# EAGLE board backplane_v4 (EAGLE 8.0.1)
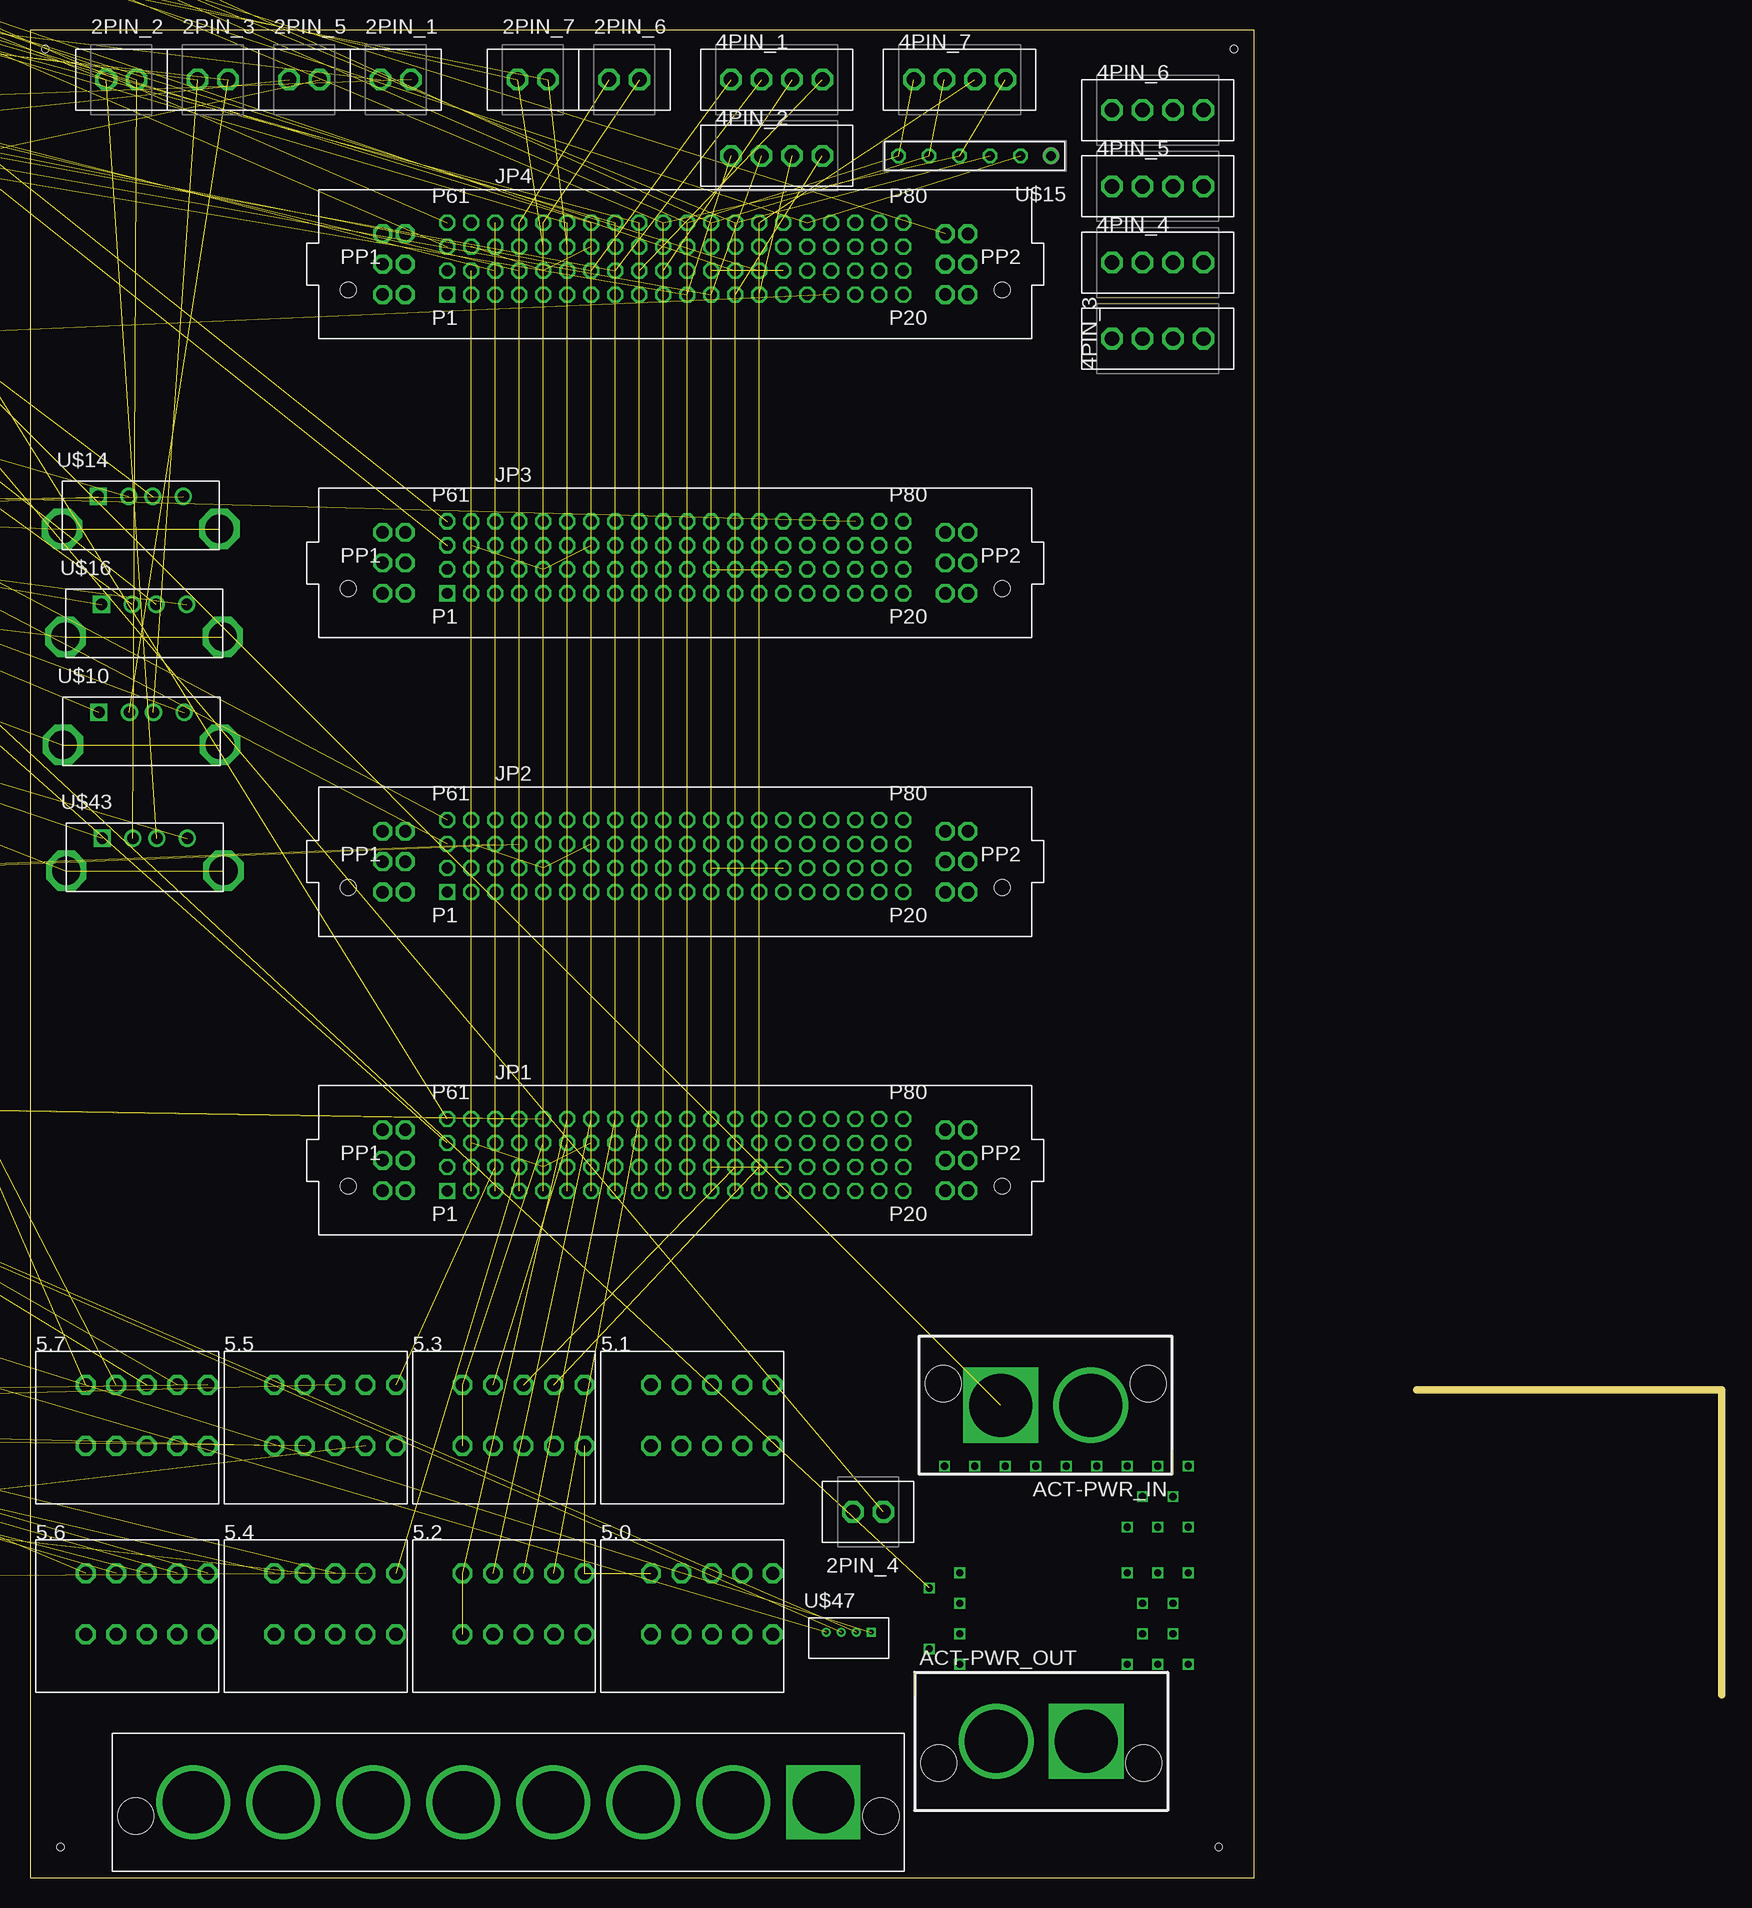
[diagram p6: board, top side]
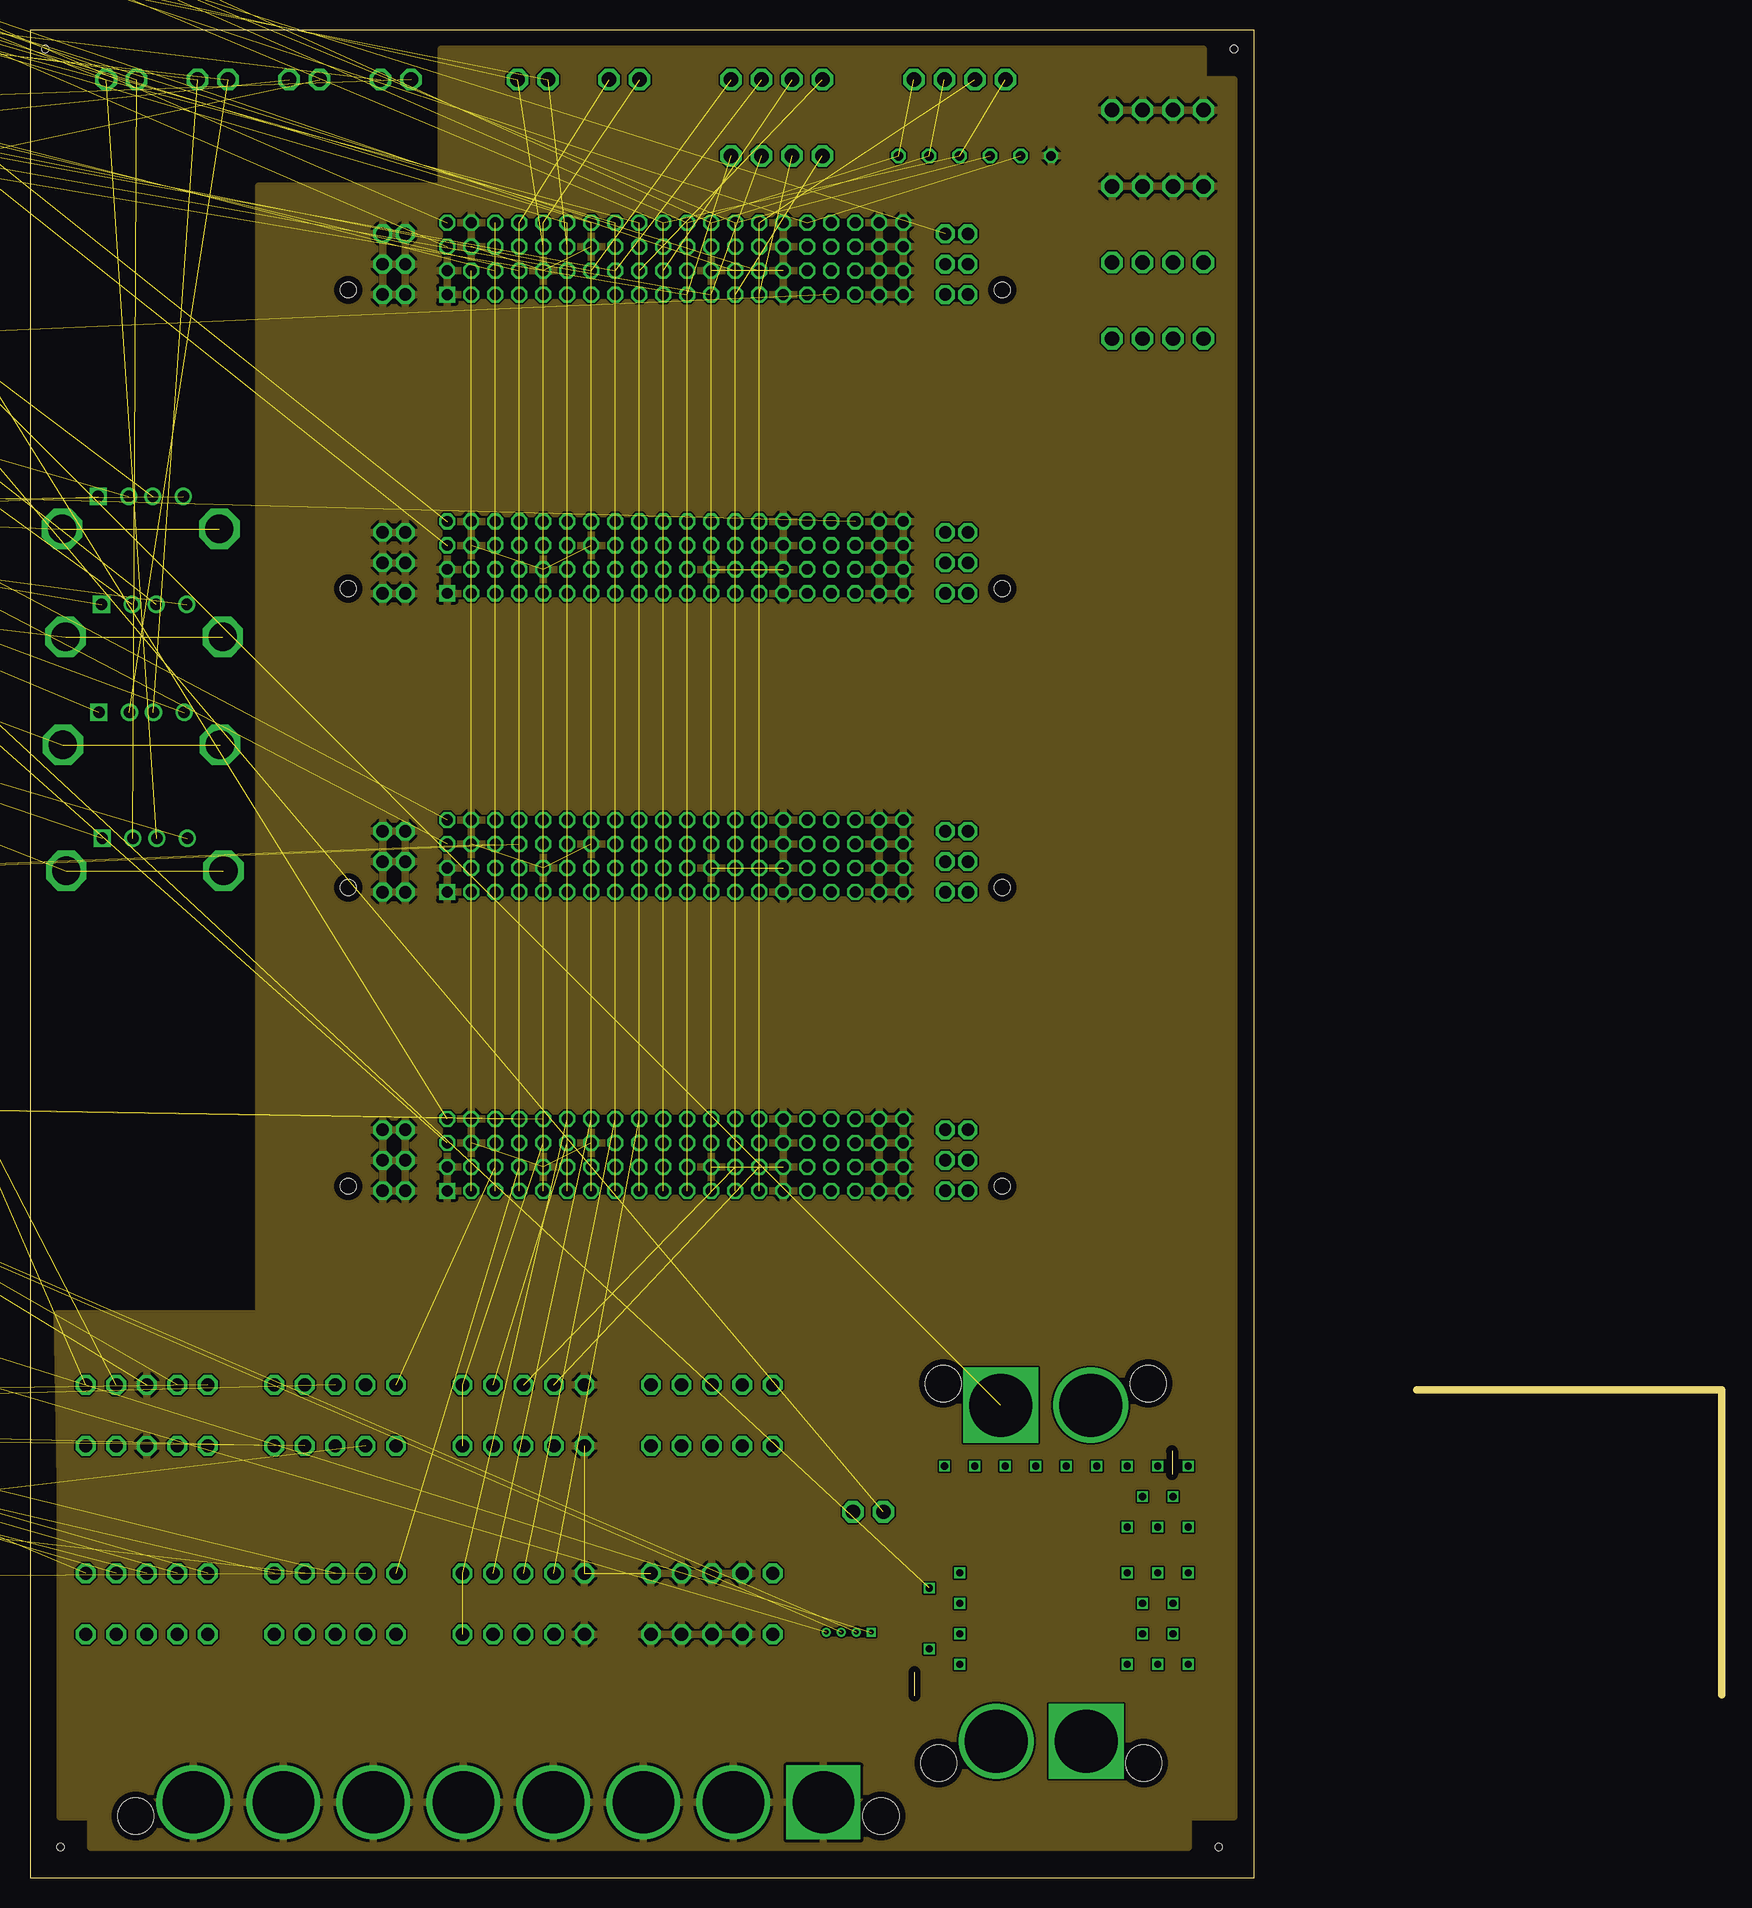
[diagram p7: board, inner layer Route2]
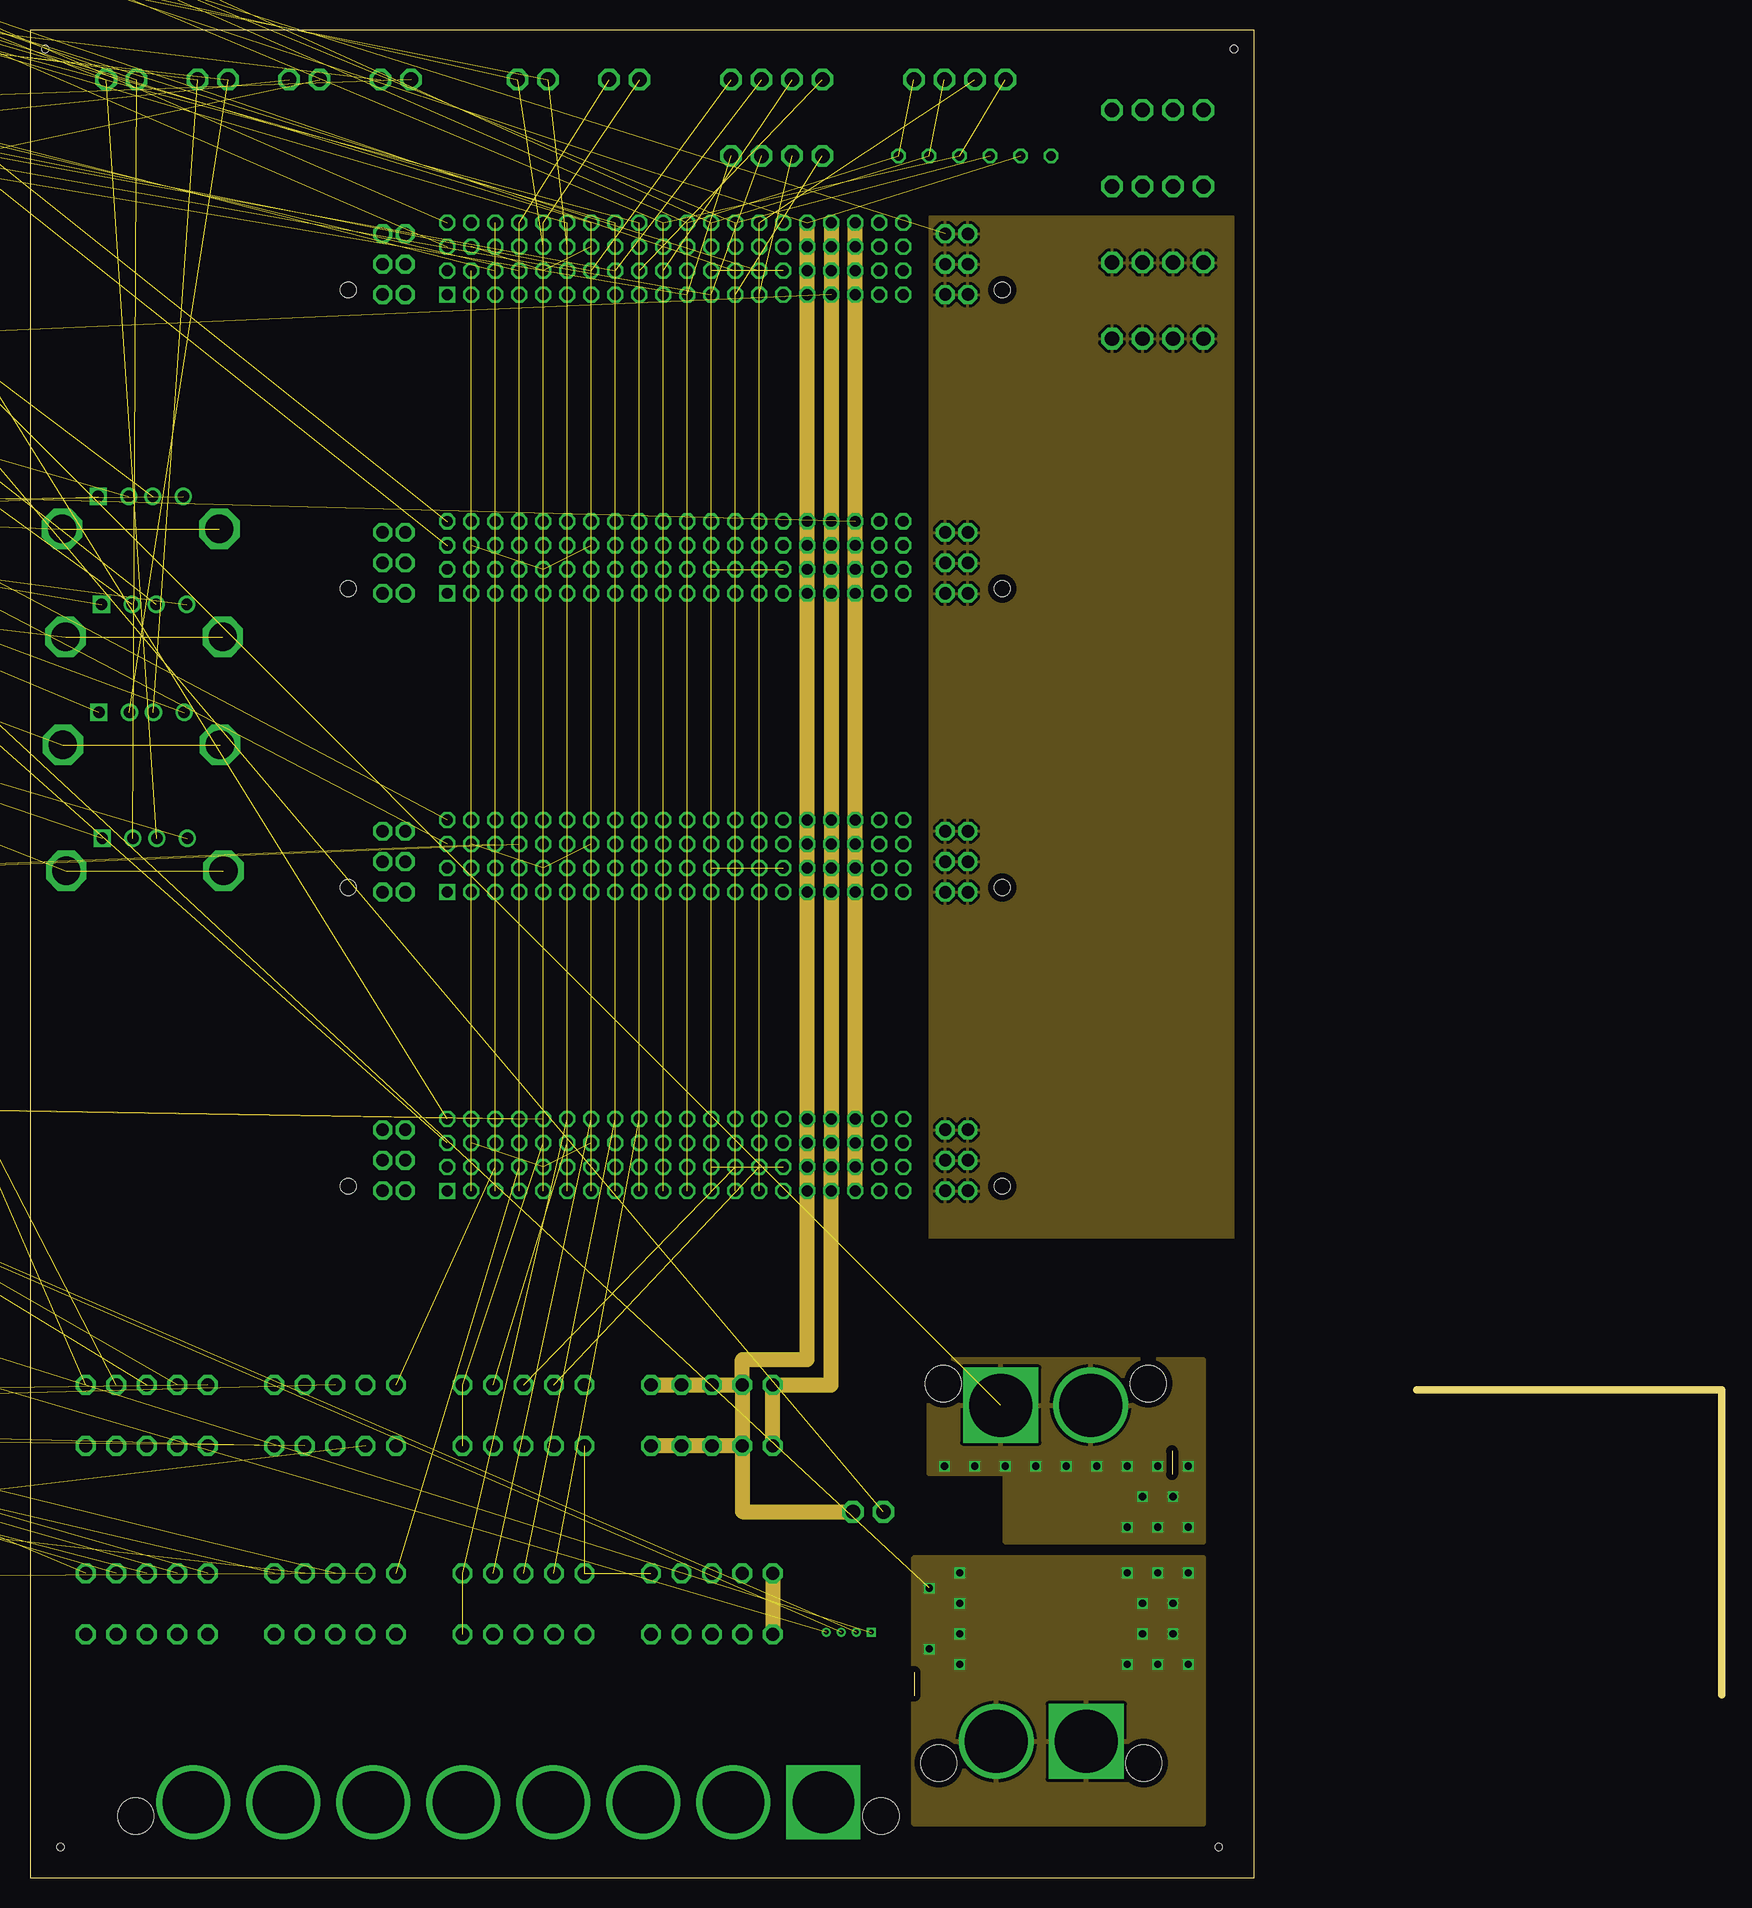
[diagram p8: board, inner layer Route15]
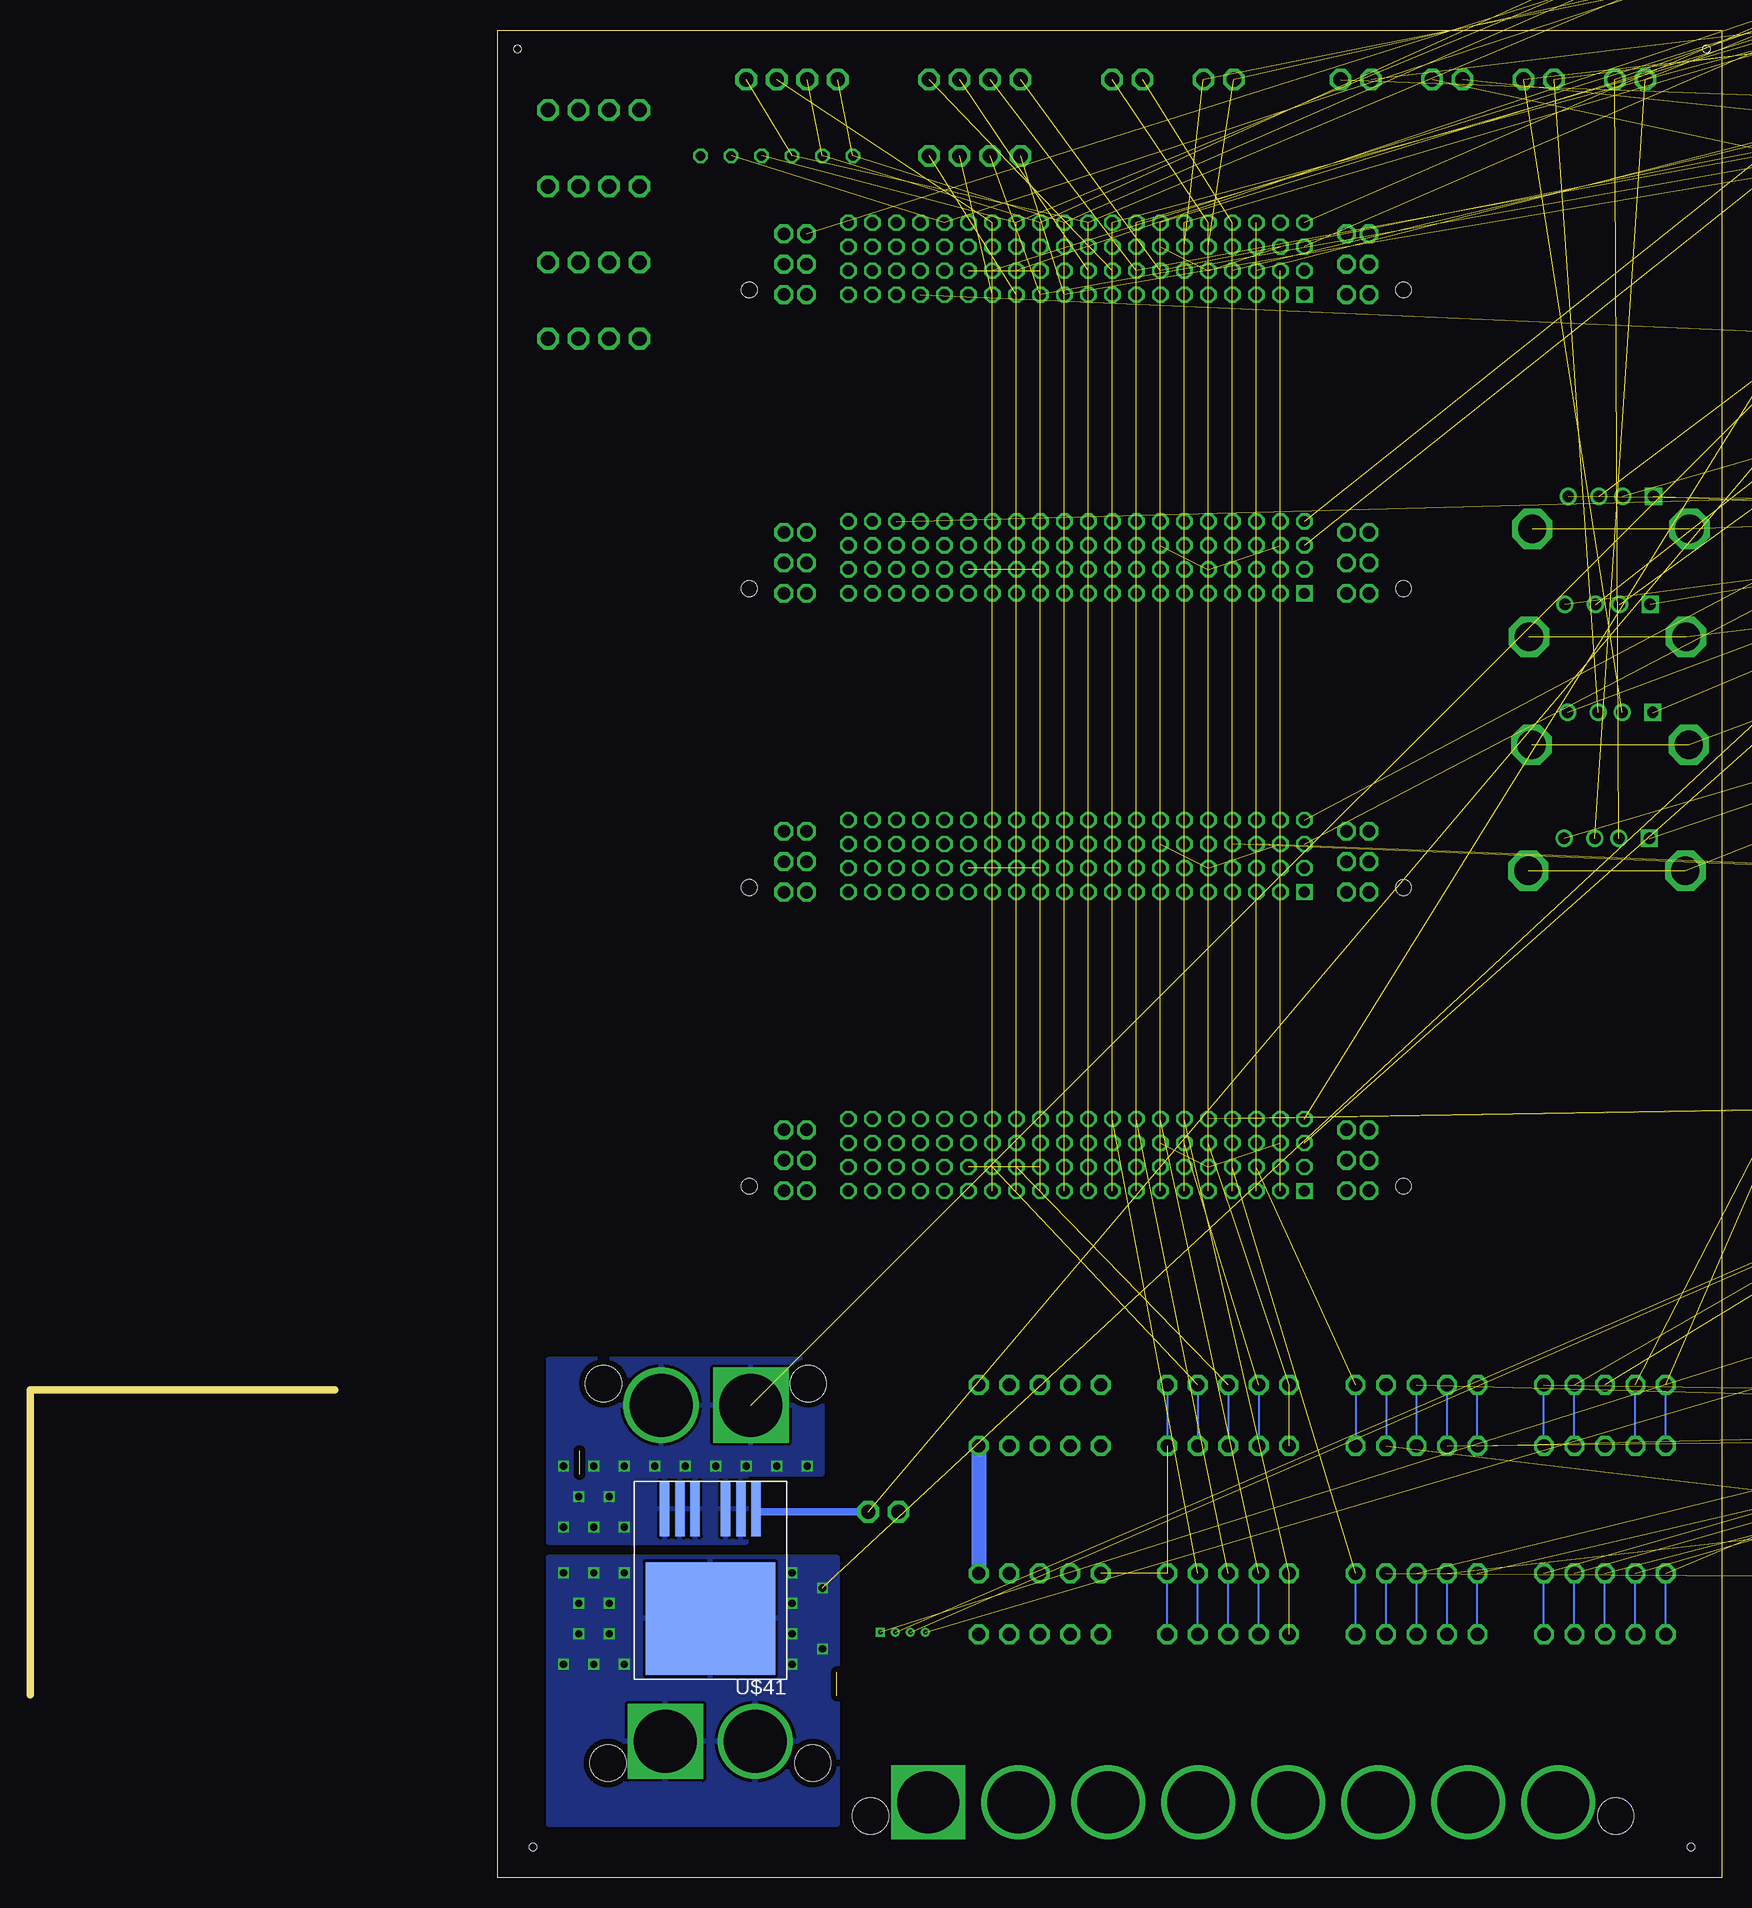
[diagram p9: board, bottom side, seen from below]

Size 140.97 x 154 mm. Coordinates in mm from the lower left corner, seen from the top.
Outline: 140.97,15.24 140.97,40.64 115.57,40.64
Outline: 0,0 102,0 102,154 0,154 0,0
Copper layers (1+2*7+8*15+16): Top 0.034290625mm / dielectric 0.24891875mm / Route2 0.034290625mm / dielectric 14mil / Route7 0.034290625mm / dielectric 0.213359375mm / Route8 0.034290625mm / dielectric 14mil / Route15 0.034290625mm / dielectric 0.24891875mm / Bottom 0.034290625mm
Design rules "6-layer_4pcb": minimum track width 6mil, minimum drill 15mil, track to track 6mil, track to pad 6mil, pad to pad 6mil, via to via 6mil, smd to smd 6mil, copper to edge 20mil, drill to drill 6mil, minimum pad ring 7mil, minimum via ring 5mil, stop-mask expansion 0mil, vias tented up to drill 0mil, thermal gap 10mil
Net classes: 0 default: width 0.152 mm, clearance 0.152 mm; 1 low-pwr: width 0.381 mm, clearance 0.152 mm; 2 med-pwr: width 0.635 mm, clearance 0.254 mm; 3 high-pwr: width 1.27 mm, clearance 0.381 mm
Holes 0.6 mm at 2.54,2.54 99.06,2.54 100.33,152.4 1.27,152.4

## Footprints (pad centres in the part's own frame; a part is rotated, then mirrored left to right if it is on the bottom)
KK254_VERT_2PIN = drill 1.2 octagon: P$1 1.27,0; P$2 -1.27,0
KK254_VERT_4PIN = drill 1.2 octagon: P$1 3.81,0; P$2 1.27,0; P$3 -1.27,0; P$4 -3.81,0
M205_5PIN = drill 1.1 octagon: P$1 6.706,3.556; P$2 6.706,-1.524; P$3 4.166,3.556; P$4 4.166,-1.524; P$5 1.626,3.556; P$6 1.626,-1.524; P$7 -0.914,3.556; P$8 -0.914,-1.524; P$9 -3.454,3.556; P$10 -3.454,-1.524
SUPERSABRE_2CIRCUIT = drill 5.25: P$1 -3.747,0 | drill 5.25 square: P$2 3.747,0 | hole 2.997: -8.534,-1.803; 8.534,-1.803
TSSOP16 = smd 1.35 x 0.6: P$1 -2.75,2.275; P$8 -2.75,-2.275; P$9 2.75,-2.275; P$16 2.75,2.275 | smd 1.35 x 0.4: P$2 -2.75,1.625; P$3 -2.75,0.975; P$4 -2.75,0.325; P$5 -2.75,-0.325; P$6 -2.75,-0.975; P$7 -2.75,-1.625; P$10 2.75,-1.625; P$11 2.75,-0.975; P$12 2.75,-0.325; P$13 2.75,0.325; P$14 2.75,0.975; P$15 2.75,1.625
C0805 = smd 1.3 x 1.5: 1 -0.85,0; 2 0.85,0
SOD123 = smd 1.4 x 1.4: A 1.9,0; C -1.9,0
QFN32 = smd 0.6 x 0.3: 1 -2.3,1.75; 2 -2.3,1.25; 3 -2.3,0.75; 4 -2.3,0.25; 5 -2.3,-0.25; 6 -2.3,-0.75; 7 -2.3,-1.25; 8 -2.3,-1.75; 17 2.3,-1.75; 18 2.3,-1.25; 19 2.3,-0.75; 20 2.3,-0.25; 21 2.3,0.25; 22 2.3,0.75; 23 2.3,1.25; 24 2.3,1.75 | smd 0.3 x 0.6: 9 -1.75,-2.3; 10 -1.25,-2.3; 11 -0.75,-2.3; 12 -0.25,-2.3; 13 0.25,-2.3; 14 0.75,-2.3; 15 1.25,-2.3; 16 1.75,-2.3; 25 1.75,2.3; 26 1.25,2.3; 27 0.75,2.3; 28 0.25,2.3; 29 -0.25,2.3; 30 -0.75,2.3; 31 -1.25,2.3; 32 -1.75,2.3 | smd 3.2 x 3.2: EXP 0,0
SSOP28DB = smd 0.348 x 1.397: 1 -4.225,-3.656; 2 -3.575,-3.656; 3 -2.925,-3.656; 4 -2.275,-3.656; 5 -1.625,-3.656; 6 -0.975,-3.656; 7 -0.325,-3.656; 8 0.325,-3.656; 9 0.975,-3.656; 10 1.625,-3.656; 11 2.275,-3.656; 12 2.925,-3.656; 13 3.575,-3.656; 14 4.225,-3.656; 15 4.225,3.656; 16 3.575,3.656; 17 2.925,3.656; 18 2.275,3.656; 19 1.625,3.656; 20 0.975,3.656; 21 0.325,3.656; 22 -0.325,3.656; 23 -0.975,3.656; 24 -1.625,3.656; 25 -2.275,3.656; 26 -2.925,3.656; 27 -3.575,3.656; 28 -4.225,3.656
QFN-28 = smd 0.3 x 0.9: P$1 -1.5,-2.215; P$2 -1,-2.215; P$3 -0.5,-2.215; P$4 0,-2.215; P$5 0.5,-2.215; P$6 1,-2.215; P$7 1.5,-2.215; P$15 1.5,2.215; P$16 1,2.215; P$17 0.5,2.215; P$18 0,2.215; P$19 -0.5,2.215; P$20 -1,2.215; P$21 -1.5,2.215 | smd 0.9 x 0.3: P$8 2.215,-1.5; P$9 2.215,-1; P$10 2.215,-0.5; P$11 2.215,0; P$12 2.215,0.5; P$13 2.215,1; P$14 2.215,1.5; P$22 -2.215,1.5; P$23 -2.215,1; P$24 -2.215,0.5; P$25 -2.215,0; P$26 -2.215,-0.5; P$27 -2.215,-1; P$28 -2.215,-1.5 | smd 3 x 3: P$29 0,0
TPS2044 = smd 0.6 x 1.55: !EN1! -1.905,-2.7; !EN2! -0.635,-2.7; !EN3! 3.175,-2.7; !EN4! 4.445,-2.7; !OC1! -4.445,2.7; !OC2! -0.635,2.7; !OC3! 0.635,2.7; !OC4! 4.445,2.7; GND1 -4.445,-2.7; GND2 0.635,-2.7; IN1 -3.175,-2.7; IN2 1.905,-2.7; OUT1 -3.175,2.7; OUT2 -1.905,2.7; OUT3 1.905,2.7; OUT4 3.175,2.7
MPTC-01-80 = drill 0.9 square: 1 -19,-2.54 | drill 0.9 octagon: 2 -17,-2.54; 3 -15,-2.54; 4 -13,-2.54; 5 -11,-2.54; 6 -9,-2.54; 7 -7,-2.54; 8 -5,-2.54; 9 -3,-2.54; 10 -1,-2.54; 11 1,-2.54; 12 3,-2.54; 13 5,-2.54; 14 7,-2.54; 15 9,-2.54; 16 11,-2.54; 17 13,-2.54; 18 15,-2.54; 19 17,-2.54; 20 19,-2.54; 21 -19,-0.54; 22 -17,-0.54; 23 -15,-0.54; 24 -13,-0.54; 25 -11,-0.54; 26 -9,-0.54; 27 -7,-0.54; 28 -5,-0.54; 29 -3,-0.54; 30 -1,-0.54; 31 1,-0.54; 32 3,-0.54; 33 5,-0.54; 34 7,-0.54; 35 9,-0.54; 36 11,-0.54; 37 13,-0.54; 38 15,-0.54; 39 17,-0.54; 40 19,-0.54; 41 -19,1.46; 42 -17,1.46; 43 -15,1.46; 44 -13,1.46; 45 -11,1.46; 46 -9,1.46; 47 -7,1.46; 48 -5,1.46; 49 -3,1.46; 50 -1,1.46; 51 1,1.46; 52 3,1.46; 53 5,1.46; 54 7,1.46; 55 9,1.46; 56 11,1.46; 57 13,1.46; 58 15,1.46; 59 17,1.46; 60 19,1.46; 61 -19,3.46; 62 -17,3.46; 63 -15,3.46; 64 -13,3.46; 65 -11,3.46; 66 -9,3.46; 67 -7,3.46; 68 -5,3.46; 69 -3,3.46; 70 -1,3.46; 71 1,3.46; 72 3,3.46; 73 5,3.46; 74 7,3.46; 75 9,3.46; 76 11,3.46; 77 13,3.46; 78 15,3.46; 79 17,3.46; 80 19,3.46 | drill 1.04 octagon: P1,1 -22.5,-2.54; P1,2 -22.5,0; P1,3 -22.5,2.54; P1,4 -24.38,2.54; P1,5 -24.38,0; P1,6 -24.38,-2.54; P2,1 22.5,-2.54; P2,2 22.5,0; P2,3 22.5,2.54; P2,4 24.38,2.54; P2,5 24.38,0; P2,6 24.38,-2.54 | hole 1.3: -27.255,-2.15; 27.255,-2.15
CHIPLED_0805 = smd 1.2 x 1.2: A 0,-1.05; C 0,1.05
CHIP-LED0805 = smd 1.2 x 1.2: A 0,-1.05; C 0,1.05
R0805 = smd 1.3 x 1.5: 1 -0.85,0; 2 0.85,0
48-LQFP_0.5MM_PITCH = smd 0.25 x 1.25: P$1 -2.75,-4.25; P$2 -2.25,-4.25; P$3 -1.75,-4.25; P$4 -1.25,-4.25; P$5 -0.75,-4.25; P$6 -0.25,-4.25; P$7 0.25,-4.25; P$8 0.75,-4.25; P$9 1.25,-4.25; P$10 1.75,-4.25; P$11 2.25,-4.25; P$12 2.75,-4.25; P$25 2.75,4.25; P$26 2.25,4.25; P$27 1.75,4.25; P$28 1.25,4.25; P$29 0.75,4.25; P$30 0.25,4.25; P$31 -0.25,4.25; P$32 -0.75,4.25; P$33 -1.25,4.25; P$34 -1.75,4.25; P$35 -2.25,4.25; P$36 -2.75,4.25 | smd 1.25 x 0.25: P$13 4.25,-2.75; P$14 4.25,-2.25; P$15 4.25,-1.75; P$16 4.25,-1.25; P$17 4.25,-0.75; P$18 4.25,-0.25; P$19 4.25,0.25; P$20 4.25,0.75; P$21 4.25,1.25; P$22 4.25,1.75; P$23 4.25,2.25; P$24 4.25,2.75; P$37 -4.25,2.75; P$38 -4.25,2.25; P$39 -4.25,1.75; P$40 -4.25,1.25; P$41 -4.25,0.75; P$42 -4.25,0.25; P$43 -4.25,-0.25; P$44 -4.25,-0.75; P$45 -4.25,-1.25; P$46 -4.25,-1.75; P$47 -4.25,-2.25; P$48 -4.25,-2.75
4-CDFN_3.2X2.5MM = smd 1 x 0.9: P$1 -0.95,1.05; P$2 -0.95,-1.05; P$3 0.95,-1.05; P$4 1.05,1.05
SOT143B = smd 1 x 0.7: P$1 -0.75,-1.05 | smd 0.7 x 0.7: P$2 0.95,-1.05; P$3 0.9,1.05; P$4 -0.9,1.05
UE27AE54100 = drill 0.95: D+ 1,1.585; D- -1,1.585; GND 3.55,1.585 | drill 2.35 octagon: SHIELD -6.55,-1.125; SHIELD1 6.55,-1.125 | drill 0.95 square: VDD -3.55,1.585
0805 = smd 1.27 x 1.016: P$1 -0.889,0; P$2 0.889,0
1206 = smd 0.9 x 1.35: P$1 -1.484,0.011; P$2 1.394,0
MEMSENSE_NIMU = hole 1.778: 1.473,5.715; 1.473,17.145; 45.06,17.145; 45.06,5.715
KK254_6PIN = drill 0.8 octagon: P$1 -6.35,0; P$2 -3.81,0; P$3 -1.27,0; P$4 1.27,0; P$5 3.81,0; P$6 6.35,0
SO8 = smd 0.6 x 2.2: 1 -1.905,-2.6; 2 -0.635,-2.6; 3 0.635,-2.6; 4 1.905,-2.6; 5 1.905,2.6; 6 0.635,2.6; 7 -0.635,2.6; 8 -1.905,2.6
PG-TO263-7-3 = smd 10.8 x 9.4: DRAIN 0,0 | smd 0.8 x 4.6: GATE -3.81,-9.15; S1 -2.54,-9.15; S2 -1.27,-9.15; S3 1.27,-9.15; S4 2.54,-9.15; S5 3.81,-9.15
SM8 = smd 0.3 x 1.6: P$1 -0.975,-1.7; P$2 -0.34,-1.7; P$3 0.295,-1.7; P$4 0.93,-1.7; P$5 0.93,1.7; P$6 0.295,1.7; P$7 -0.34,1.7; P$8 -0.975,1.7
DF13-4 = drill 0.381 square: P$1 1.875,0.49 | drill 0.381: P$2 0.625,0.49; P$3 -0.625,0.49; P$4 -1.875,0.49
SUPERSABRE_8-PIN = drill 5.15 square: P$1 26.25,0 | drill 5.15: P$2 18.75,0; P$3 11.25,0; P$4 3.75,0; P$5 -3.75,0; P$6 -11.25,0; P$7 -18.75,0; P$8 -26.25,0 | hole 3: -31.05,-1.145; 31.05,-1.145

## Placement (x,y rotation side)
2PIN_1  CPU_USB_HUB  [KK254_VERT_2PIN]  30.48,149.86 0 top
2PIN_2  CPU_USB_AHRS  [KK254_VERT_2PIN]  7.62,149.86 0 top
2PIN_3  CPU_USB_IMU  [KK254_VERT_2PIN]  15.24,149.86 0 top
2PIN_4  Magnetic Reed Switch plug  [KK254_VERT_2PIN]  69.85,30.48 180 top
2PIN_5  CPU_USB_DVL  [KK254_VERT_2PIN]  22.86,149.86 0 top
2PIN_6  CPU_I2C_1  [KK254_VERT_2PIN]  49.53,149.86 0 top
2PIN_7  CPU_CAN  [KK254_VERT_2PIN]  41.91,149.86 0 top
4PIN_1  CPU_RS232_MCU  [KK254_VERT_4PIN]  62.23,149.86 0 top
4PIN_2  CPU_RS232_Flex  [KK254_VERT_4PIN]  62.23,143.51 0 top
4PIN_3  CPU_PWR1  [KK254_VERT_4PIN]  93.98,128.27 0 top
4PIN_4  CPU_PWR2  [KK254_VERT_4PIN]  93.98,134.62 0 top
4PIN_5  CPU_GND1  [KK254_VERT_4PIN]  93.98,140.97 0 top
4PIN_6  CPU_GND2  [KK254_VERT_4PIN]  93.98,147.32 0 top
4PIN_7  CPU_SPI  [KK254_VERT_4PIN]  77.47,149.86 0 top
5.0  M250_5PIN  [M205_5PIN]  55.2,21.8 0 top
5.1  M250_5PIN  [M205_5PIN]  55.2,37.5 0 top
5.2  M250_5PIN  [M205_5PIN]  39.5,21.8 0 top
5.3  M250_5PIN  [M205_5PIN]  39.5,37.5 0 top
5.4  M250_5PIN  [M205_5PIN]  23.8,21.8 0 top
5.5  M250_5PIN  [M205_5PIN]  23.8,37.5 0 top
5.6  M250_5PIN  [M205_5PIN]  8.1,21.8 0 top
5.7  M250_5PIN  [M205_5PIN]  8.1,37.5 0 top
ACT-PWR_IN  SUPERSABRE_2CIRCUIT  [SUPERSABRE_2CIRCUIT]  84.64,39.37 180 top
ACT-PWR_OUT  SUPERSABRE_2CIRCUIT  [SUPERSABRE_2CIRCUIT]  84.27,11.35 0 top
BATTERY-MUX  PCA9546APW  [TSSOP16]  -76.86,51.3 0 bottom  (outside the outline)
C1  22p  [C0805]  -21.59,147.32 0 top  (outside the outline)
C2  22p  [C0805]  -26.67,147.32 0 top  (outside the outline)
C3  22p  [C0805]  -31.75,147.32 0 top  (outside the outline)
C4  100n  [C0805]  -127,120.65 0 top  (outside the outline)
C5  4.7u  [C0805]  -16.51,128.27 0 top  (outside the outline)
C6  100n  [C0805]  -133.35,120.65 0 top  (outside the outline)
C7  100n  [C0805]  -139.7,120.65 0 top  (outside the outline)
C8  100n  [C0805]  -146.05,120.65 0 top  (outside the outline)
C9  4.7u  [C0805]  -22.86,128.27 0 top  (outside the outline)
C10  100n  [C0805]  -152.4,120.65 0 top  (outside the outline)
C11  100n  [C0805]  -158.75,120.65 0 top  (outside the outline)
C16  0.1u  [C0805]  -29.21,128.27 0 top  (outside the outline)
C17  0.1u  [C0805]  -35.56,128.27 0 top  (outside the outline)
C18  0.1u  [C0805]  -41.91,128.27 0 top  (outside the outline)
C19  0.1u  [C0805]  -48.26,128.27 0 top  (outside the outline)
C20  0.1u  [C0805]  -54.61,128.27 0 top  (outside the outline)
C26  0.1u  [C0805]  -60.96,128.27 0 top  (outside the outline)
C27  0.1u  [C0805]  -67.31,128.27 0 top  (outside the outline)
C28  4.7u  [C0805]  -73.66,128.27 0 top  (outside the outline)
C29  0.1u  [C0805]  -80.01,128.27 0 top  (outside the outline)
C30  22p  [C0805]  -72.39,140.97 0 top  (outside the outline)
C31  22p  [C0805]  -77.47,140.97 0 top  (outside the outline)
C32  22p  [C0805]  -82.55,140.97 0 top  (outside the outline)
C33  22p  [C0805]  -87.63,140.97 0 top  (outside the outline)
C34  22p  [C0805]  -92.71,140.97 0 top  (outside the outline)
C35  22p  [C0805]  -97.79,140.97 0 top  (outside the outline)
C36  22p  [C0805]  -102.87,140.97 0 top  (outside the outline)
C37  22p  [C0805]  -107.95,140.97 0 top  (outside the outline)
C38  22p  [C0805]  -113.03,140.97 0 top  (outside the outline)
C39  22p  [C0805]  -118.11,140.97 0 top  (outside the outline)
C40  22p  [C0805]  -123.19,140.97 0 top  (outside the outline)
C41  22p  [C0805]  -128.27,140.97 0 top  (outside the outline)
C42  22p  [C0805]  -133.35,140.97 0 top  (outside the outline)
C43  22p  [C0805]  -138.43,140.97 0 top  (outside the outline)
C44  22p  [C0805]  -143.51,140.97 0 top  (outside the outline)
C45  22p  [C0805]  -148.59,140.97 0 top  (outside the outline)
C46  22p  [C0805]  -153.67,140.97 0 top  (outside the outline)
C47  22p  [C0805]  -158.75,140.97 0 top  (outside the outline)
C48  22p  [C0805]  -163.83,140.97 0 top  (outside the outline)
D1  14V  [SOD123]  -25.4,153.67 0 top  (outside the outline)
D2  5V  [SOD123]  -31.75,153.67 0 top  (outside the outline)
D3  5V  [SOD123]  -38.1,153.67 0 top  (outside the outline)
D4  12V  [SOD123]  -44.45,153.67 0 top  (outside the outline)
D5  12V  [SOD123]  -50.8,153.67 0 top  (outside the outline)
D6  12V  [SOD123]  -57.15,153.67 0 top  (outside the outline)
D7  12V  [SOD123]  -63.5,153.67 0 top  (outside the outline)
D8  V_BATT  [SOD123]  -55.88,147.32 0 top  (outside the outline)
D9  V_BATT  [SOD123]  -64.77,147.32 0 top  (outside the outline)
D10  5V  [SOD123]  -69.85,153.67 0 top  (outside the outline)
D11  12V  [SOD123]  -76.2,153.67 0 top  (outside the outline)
D12  5V  [SOD123]  -82.55,153.67 0 top  (outside the outline)
D13  3V3  [SOD123]  -88.9,153.67 0 top  (outside the outline)
D14  V_BATT  [SOD123]  -73.66,147.32 0 top  (outside the outline)
D15  12V  [SOD123]  -95.25,153.67 0 top  (outside the outline)
D16  5V  [SOD123]  -101.6,153.67 0 top  (outside the outline)
D17  3V3  [SOD123]  -107.95,153.67 0 top  (outside the outline)
D18  V_BATT  [SOD123]  -82.55,147.32 0 top  (outside the outline)
D19  12V  [SOD123]  -114.3,153.67 0 top  (outside the outline)
D20  5V  [SOD123]  -120.65,153.67 0 top  (outside the outline)
D21  3V3  [SOD123]  -127,153.67 0 top  (outside the outline)
D22  V_BATT  [SOD123]  -91.44,147.32 0 top  (outside the outline)
D23  12V  [SOD123]  -133.35,153.67 0 top  (outside the outline)
D24  5V  [SOD123]  -139.7,153.67 0 top  (outside the outline)
D25  3V3  [SOD123]  -146.05,153.67 0 top  (outside the outline)
D26  V_BATT  [SOD123]  -100.33,147.32 0 top  (outside the outline)
D27  12V  [SOD123]  -152.4,153.67 0 top  (outside the outline)
D28  V_BATT  [SOD123]  -109.22,147.32 0 top  (outside the outline)
D29  V_BATT  [SOD123]  -118.11,147.32 0 top  (outside the outline)
D30  V_BATT  [SOD123]  -127,147.32 0 top  (outside the outline)
D31  V_BATT  [SOD123]  -135.89,147.32 0 top  (outside the outline)
D32  V_BATT  [SOD123]  -144.78,147.32 0 top  (outside the outline)
D33  V_BATT  [SOD123]  -153.67,147.32 0 top  (outside the outline)
D34  V_BATT  [SOD123]  -162.56,147.32 0 top  (outside the outline)
D35  V_BATT  [SOD123]  -19.05,153.67 0 top  (outside the outline)
D36  5V  [SOD123]  -158.75,153.67 0 top  (outside the outline)
D37  5V  [SOD123]  -165.1,153.67 0 top  (outside the outline)
D39  5V  [SOD123]  -16.51,160.02 0 top  (outside the outline)
D40  5V  [SOD123]  -22.86,160.02 0 top  (outside the outline)
D41  5V  [SOD123]  -29.21,160.02 0 top  (outside the outline)
DVL_HOST_FTDI  FT232RQ  [QFN32]  -47.61,70.43 0 bottom  (outside the outline)
DVL_SLAVE_FTDI  FT232RQ  [QFN32]  -28.8,79.16 0 bottom  (outside the outline)
DVL_TTL-TO-RS232  MAX213CDBR  [SSOP28DB]  -32.26,41.4 90 bottom  (outside the outline)
DVL_USB_HUB  USB2412-DZK  [QFN-28]  -26.42,103.12 0 bottom  (outside the outline)
G1  TPS2044BBD-SOIC  [TPS2044]  -88.65,97.54 0 bottom  (outside the outline)
JP1  MPTC-01-80  [MPTC-01-80]  53.77,59.78 0 top
JP2  MPTC-01-80  [MPTC-01-80]  53.77,84.68 0 top
JP3  MPTC-01-80  [MPTC-01-80]  53.77,109.58 0 top
JP4  MPTC-01-80  [MPTC-01-80]  53.77,134.48 0 top
LED1  Red  [CHIPLED_0805]  -87.63,165.1 0 top  (outside the outline)
LED2  Green  [CHIPLED_0805]  -73.66,119.38 0 top  (outside the outline)
LED3  Red  [CHIPLED_0805]  -93.98,165.1 0 top  (outside the outline)
LED4  Green  [CHIPLED_0805]  -80.01,119.38 0 top  (outside the outline)
LED7  Green  [CHIPLED_0805]  -86.36,119.38 0 top  (outside the outline)
LED8  Green  [CHIP-LED0805]  -92.71,119.38 0 top  (outside the outline)
LED9  Red  [CHIP-LED0805]  -100.33,165.1 0 top  (outside the outline)
LED10  Red  [CHIP-LED0805]  -35.56,119.38 0 top  (outside the outline)
LED11  Green  [CHIP-LED0805]  -41.91,119.38 0 top  (outside the outline)
LED12  Red  [CHIP-LED0805]  -48.26,119.38 0 top  (outside the outline)
LED13  Green  [CHIP-LED0805]  -54.61,119.38 0 top  (outside the outline)
LED14  Red  [CHIP-LED0805]  -60.96,119.38 0 top  (outside the outline)
LED15  Green  [CHIP-LED0805]  -67.31,119.38 0 top  (outside the outline)
R1  200k  [R0805]  -120.65,120.65 0 top  (outside the outline)
R2  15k  [R0805]  -16.51,147.32 0 top  (outside the outline)
R3  27  [R0805]  -36.83,147.32 0 top  (outside the outline)
R4  270  [R0805]  -52.07,140.97 0 top  (outside the outline)
R5  270  [R0805]  -57.15,140.97 0 top  (outside the outline)
R6  270  [R0805]  -62.23,140.97 0 top  (outside the outline)
R7  270  [R0805]  -67.31,140.97 0 top  (outside the outline)
R8  5k  [R0805]  -41.91,147.32 0 top  (outside the outline)
R9  5k  [R0805]  -46.99,147.32 0 top  (outside the outline)
R10  50k  [R0805]  -85.09,128.27 0 top  (outside the outline)
R11  50k  [R0805]  -90.17,128.27 0 top  (outside the outline)
R12  12k+/-1%  [R0805]  -114.3,120.65 0 top  (outside the outline)
R13  100>R>40  [R0805]  -104.14,120.65 0 top  (outside the outline)
R14  50k  [R0805]  -95.25,128.27 0 top  (outside the outline)
R15  50k  [R0805]  -100.33,128.27 0 top  (outside the outline)
R16  1.5k  [R0805]  -165.1,120.65 0 top  (outside the outline)
R17  27  [R0805]  -105.41,128.27 0 top  (outside the outline)
R18  330  [R0805]  -110.49,128.27 0 top  (outside the outline)
R19  330  [R0805]  -115.57,128.27 0 top  (outside the outline)
R20  330  [R0805]  -120.65,128.27 0 top  (outside the outline)
R21  330  [R0805]  -125.73,128.27 0 top  (outside the outline)
R22  27  [R0805]  -130.81,128.27 0 top  (outside the outline)
R23  27  [R0805]  -135.89,128.27 0 top  (outside the outline)
R24  27  [R0805]  -140.97,128.27 0 top  (outside the outline)
R25  27  [R0805]  -146.05,128.27 0 top  (outside the outline)
R26  27  [R0805]  -151.13,128.27 0 top  (outside the outline)
R27  27  [R0805]  -156.21,128.27 0 top  (outside the outline)
R28  27  [R0805]  -161.29,128.27 0 top  (outside the outline)
R29  27  [R0805]  -166.37,128.27 0 top  (outside the outline)
R30  27  [R0805]  -16.51,134.62 0 top  (outside the outline)
R31  27  [R0805]  -21.59,134.62 0 top  (outside the outline)
R32  27  [R0805]  -26.67,134.62 0 top  (outside the outline)
R33  27  [R0805]  -31.75,134.62 0 top  (outside the outline)
R34  27  [R0805]  -36.83,134.62 0 top  (outside the outline)
R35  27  [R0805]  -41.91,134.62 0 top  (outside the outline)
R36  15k  [R0805]  -46.99,134.62 0 top  (outside the outline)
R37  15k  [R0805]  -52.07,134.62 0 top  (outside the outline)
R38  15k  [R0805]  -57.15,134.62 0 top  (outside the outline)
R39  15k  [R0805]  -62.23,134.62 0 top  (outside the outline)
R40  15k  [R0805]  -67.31,134.62 0 top  (outside the outline)
R41  15k  [R0805]  -72.39,134.62 0 top  (outside the outline)
R42  15k  [R0805]  -77.47,134.62 0 top  (outside the outline)
R43  15k  [R0805]  -82.55,134.62 0 top  (outside the outline)
R44  15k  [R0805]  -87.63,134.62 0 top  (outside the outline)
R45  15k  [R0805]  -92.71,134.62 0 top  (outside the outline)
R46  15k  [R0805]  -97.79,134.62 0 top  (outside the outline)
R47  15k  [R0805]  -102.87,134.62 0 top  (outside the outline)
R48  15k  [R0805]  -107.95,134.62 0 top  (outside the outline)
R49  27  [R0805]  -113.03,134.62 0 top  (outside the outline)
R50  15k  [R0805]  -118.11,134.62 0 top  (outside the outline)
R51  27  [R0805]  -123.19,134.62 0 top  (outside the outline)
R52  15k  [R0805]  -128.27,134.62 0 top  (outside the outline)
R53  27  [R0805]  -133.35,134.62 0 top  (outside the outline)
R54  15k  [R0805]  -138.43,134.62 0 top  (outside the outline)
R55  27  [R0805]  -143.51,134.62 0 top  (outside the outline)
R56  15k  [R0805]  -148.59,134.62 0 top  (outside the outline)
R57  27  [R0805]  -153.67,134.62 0 top  (outside the outline)
R58  15k  [R0805]  -158.75,134.62 0 top  (outside the outline)
R59  27  [R0805]  -163.83,134.62 0 top  (outside the outline)
R60  15k  [R0805]  -16.51,140.97 0 top  (outside the outline)
R61  50k  [R0805]  -21.59,140.97 0 top  (outside the outline)
R62  5k  [R0805]  -26.67,140.97 0 top  (outside the outline)
R63  5k  [R0805]  -31.75,140.97 0 top  (outside the outline)
R64  15k  [R0805]  -36.83,140.97 0 top  (outside the outline)
R65  15k  [R0805]  -41.91,140.97 0 top  (outside the outline)
R66  15k  [R0805]  -46.99,140.97 0 top  (outside the outline)
R67  1.5k  [R0805]  -184.15,-58.53 0 top  (outside the outline)
R68  1.5k  [R0805]  -184.15,-63.74 0 top  (outside the outline)
R72  1.5k  [R0805]  -184.15,-53.32 0 top  (outside the outline)
U1  TUSB2077ALQFP  [48-LQFP_0.5MM_PITCH]  -55.34,99.39 270 bottom  (outside the outline)
U$1  24MHz  [4-CDFN_3.2X2.5MM]  -20.32,114.3 0 bottom  (outside the outline)
U$2  PRTR5V0U2X  [SOT143B]  -105.41,165.1 0 top  (outside the outline)
U$3  PRTR5V0U2X  [SOT143B]  -110.49,165.1 0 top  (outside the outline)
U$4  PRTR5V0U2X  [SOT143B]  -115.57,165.1 0 top  (outside the outline)
U$5  PRTR5V0U2X  [SOT143B]  -120.65,165.1 0 top  (outside the outline)
U$6  PRTR5V0U2X  [SOT143B]  -125.73,165.1 0 top  (outside the outline)
U$7  PRTR5V0U2X  [SOT143B]  -130.81,165.1 0 top  (outside the outline)
U$8  PRTR5V0U2X  [SOT143B]  -135.89,165.1 0 top  (outside the outline)
U$9  PRTR5V0U2X  [SOT143B]  -140.97,165.1 0 top  (outside the outline)
U$10  IMU USB header  [UE27AE54100]  9.29,95.54 0 top
U$11  [0805]  -116.84,170.18 0 top  (outside the outline)
U$12  100u_tant  [1206]  -34.29,160.02 0 top  (outside the outline)
U$13  MEMSENSE_NIMU  [MEMSENSE_NIMU]  -117.6,-11.94 90 top  (outside the outline)
U$14  [UE27AE54100]  9.23,113.54 0 top
U$15  SPI_LEDS  [KK254_6PIN]  78.74,143.51 180 top
U$16  [UE27AE54100]  9.51,104.54 0 top
U$17  [R0805]  -184.15,176.53 0 top  (outside the outline)
U$18  PRTR5V0U2X  [SOT143B]  -146.05,165.1 0 top  (outside the outline)
U$19  PRTR5V0U2X  [SOT143B]  -151.13,165.1 0 top  (outside the outline)
U$20  PRTR5V0U2X  [SOT143B]  -156.21,165.1 0 top  (outside the outline)
U$21  [R0805]  -184.15,170.18 0 top  (outside the outline)
U$22  PRTR5V0U2X  [SOT143B]  -161.29,165.1 0 top  (outside the outline)
U$23  PRTR5V0U2X  [SOT143B]  -15.24,171.45 0 top  (outside the outline)
U$24  [0805]  -121.92,170.18 0 top  (outside the outline)
U$25  [0805]  -127,170.18 0 top  (outside the outline)
U$26  [R0805]  -184.15,163.83 0 top  (outside the outline)
U$27  PRTR5V0U2X  [SOT143B]  -20.32,171.45 0 top  (outside the outline)
U$28  PRTR5V0U2X  [SOT143B]  -25.4,171.45 0 top  (outside the outline)
U$29  PRTR5V0U2X  [SOT143B]  -30.48,171.45 0 top  (outside the outline)
U$30  PRTR5V0U2X  [SOT143B]  -35.56,171.45 0 top  (outside the outline)
U$31  PRTR5V0U2X  [SOT143B]  -40.64,171.45 0 top  (outside the outline)
U$32  PRTR5V0U2X  [SOT143B]  -45.72,171.45 0 top  (outside the outline)
U$33  48MHz  [4-CDFN_3.2X2.5MM]  -36.07,109.73 0 bottom  (outside the outline)
U$34  100u_tant  [1206]  -39.37,160.02 0 top  (outside the outline)
U$35  100u_tant  [1206]  -44.45,160.02 0 top  (outside the outline)
U$36  [R0805]  -184.15,157.48 0 top  (outside the outline)
U$37  P82B715  [SO8]  -52.04,41.66 0 bottom  (outside the outline)
U$38  P82B715  [SO8]  -77.86,80.9 270 bottom  (outside the outline)
U$39  P82B715  [SO8]  -69.41,24.05 270 bottom  (outside the outline)
U$40  P82B715  [SO8]  -78.23,36.44 270 bottom  (outside the outline)
U$41  IPB180P04P4L-02  [PG-TO263-7-3]  84.27,21.59 180 bottom
U$42  PRTR5V0U2X  [SOT143B]  -50.8,171.45 0 top  (outside the outline)
U$43  AHRS USB header  [UE27AE54100]  9.57,85.04 0 top
U$44  [0805]  -132.08,170.18 0 top  (outside the outline)
U$45  100u_tant  [1206]  -49.53,160.02 0 top  (outside the outline)
U$46  I2C level shifter  [SM8]  -21.78,61.37 0 bottom  (outside the outline)
U$47  Depth Sensor header  [DF13-4]  68.23,19.96 0 top
U$48  [0805]  -137.16,170.18 0 top  (outside the outline)
U$49  100u_tant  [1206]  -54.61,160.02 0 top  (outside the outline)
U$50  P82B715  [SO8]  -76.39,64.49 270 bottom  (outside the outline)
U$51  100u_tant  [1206]  -59.69,160.02 0 top  (outside the outline)
U$52  PRTR5V0U2X  [SOT143B]  -55.88,171.45 0 top  (outside the outline)
U$53  PRTR5V0U2X  [SOT143B]  -60.96,171.45 0 top  (outside the outline)
U$54  PRTR5V0U2X  [SOT143B]  -66.04,171.45 0 top  (outside the outline)
U$55  PRTR5V0U2X  [SOT143B]  -71.12,171.45 0 top  (outside the outline)
U$56  PRTR5V0U2X  [SOT143B]  -76.2,171.45 0 top  (outside the outline)
U$57  PRTR5V0U2X  [SOT143B]  -81.28,171.45 0 top  (outside the outline)
U$58  PRTR5V0U2X  [SOT143B]  -86.36,171.45 0 top  (outside the outline)
U$59  PRTR5V0U2X  [SOT143B]  -91.44,171.45 0 top  (outside the outline)
U$60  PRTR5V0U2X  [SOT143B]  -96.52,171.45 0 top  (outside the outline)
U$61  PRTR5V0U2X  [SOT143B]  -101.6,171.45 0 top  (outside the outline)
U$62  PRTR5V0U2X  [SOT143B]  -106.68,171.45 0 top  (outside the outline)
U$63  PRTR5V0U2X  [SOT143B]  -111.76,171.45 0 top  (outside the outline)
U$64  0.1u_tant  [1206]  -64.77,160.02 0 top  (outside the outline)
U$65  0.1u_tant  [1206]  -69.85,160.02 0 top  (outside the outline)
U$66  0.1u_tant  [1206]  -74.93,160.02 0 top  (outside the outline)
U$67  0.1u_tant  [1206]  -80.01,160.02 0 top  (outside the outline)
U$68  [0805]  -142.24,170.18 0 top  (outside the outline)
U$69  100u_tant  [1206]  -85.09,160.02 0 top  (outside the outline)
U$70  0.1u_tant  [1206]  -90.17,160.02 0 top  (outside the outline)
U$71  0.1u_tant  [1206]  -95.25,160.02 0 top  (outside the outline)
U$72  0.1u_tant  [1206]  -100.33,160.02 0 top  (outside the outline)
U$73  0.1u_tant  [1206]  -105.41,160.02 0 top  (outside the outline)
U$74  [R0805]  -184.15,151.13 0 top  (outside the outline)
U$75  0.1u_tant  [1206]  -110.49,160.02 0 top  (outside the outline)
U$76  0.1u_tant  [1206]  -115.57,160.02 0 top  (outside the outline)
U$77  0.1u_tant  [1206]  -120.65,160.02 0 top  (outside the outline)
U$78  0.1u_tant  [1206]  -125.73,160.02 0 top  (outside the outline)
U$79  0.1u_tant  [1206]  -130.81,160.02 0 top  (outside the outline)
U$80  0.1u_tant  [1206]  -135.89,160.02 0 top  (outside the outline)
U$81  0.1u_tant  [1206]  -140.97,160.02 0 top  (outside the outline)
U$82  0.1u_tant  [1206]  -146.05,160.02 0 top  (outside the outline)
U$83  0.1u_tant  [1206]  -151.13,160.02 0 top  (outside the outline)
U$84  0.1u_tant  [1206]  -156.21,160.02 0 top  (outside the outline)
U$85  0.1u_tant  [1206]  -161.29,160.02 0 top  (outside the outline)
U$86  0.1u_tant  [1206]  -15.24,166.37 0 top  (outside the outline)
U$87  0.1u_tant  [1206]  -20.32,166.37 0 top  (outside the outline)
U$88  0.1u_tant  [1206]  -25.4,166.37 0 top  (outside the outline)
U$89  0.1u_tant  [1206]  -30.48,166.37 0 top  (outside the outline)
U$90  0.1u_tant  [1206]  -35.56,166.37 0 top  (outside the outline)
U$91  0.1u_tant  [1206]  -40.64,166.37 0 top  (outside the outline)
U$92  0.1u_tant  [1206]  -45.72,166.37 0 top  (outside the outline)
U$93  0.1u_tant  [1206]  -50.8,166.37 0 top  (outside the outline)
U$94  0.1u_tant  [1206]  -55.88,166.37 0 top  (outside the outline)
U$95  0.1u_tant  [1206]  -60.96,166.37 0 top  (outside the outline)
U$96  0.1u_tant  [1206]  -66.04,166.37 0 top  (outside the outline)
U$97  0.1u_tant  [1206]  -71.12,166.37 0 top  (outside the outline)
U$98  0.1u_tant  [1206]  -76.2,166.37 0 top  (outside the outline)
U$99  0.1u_tant  [1206]  -81.28,166.37 0 top  (outside the outline)
U$100  SYSTEM GROUND  [SUPERSABRE_8-PIN]  39.87,6.26 0 top
U$101  [R0805]  -184.15,144.78 0 top  (outside the outline)
U$102  [R0805]  -184.15,138.43 0 top  (outside the outline)
U$103  [R0805]  -184.15,132.08 0 top  (outside the outline)
U$104  [R0805]  -184.15,125.73 0 top  (outside the outline)
U$105  [R0805]  -184.15,119.38 0 top  (outside the outline)
U$106  [R0805]  -184.15,113.03 0 top  (outside the outline)
U$107  [R0805]  -184.15,106.68 0 top  (outside the outline)
U$108  [R0805]  -184.15,100.33 0 top  (outside the outline)
U$109  [R0805]  -184.15,93.98 0 top  (outside the outline)

## Tracks (layer width: path | path; a pad name or v marks a point on that pad's centre or on a via)
3V3  (49 unrouted)
  Route15 1.27: JP1.18 JP1.38 JP1.58 JP1.78 JP2.18 JP2.38 JP2.58 JP2.78 JP3.18 JP3.38 JP3.58 JP3.78 JP4.18 JP4.38 JP4.58 JP4.78
5V  (85 unrouted)
  Route15 1.27: JP4.77 JP4.57 JP4.37 JP4.17 JP3.77 JP3.57 JP3.37 JP3.17 JP2.77 JP2.57 JP2.37 JP2.17 JP1.77 JP1.57 JP1.37 JP1.17 66.77,41.06 5.1.P$1 5.1.P$2 | 5.0.P$1 5.0.P$2
  Bottom 1.27: 5.1.P$2 5.0.P$1
12V  (19 unrouted)
  Route15 1.27: JP4.76 JP4.56 JP4.36 JP4.16 JP3.76 JP3.56 JP3.36 JP3.16 JP2.76 JP2.56 JP2.36 JP2.16 JP1.76 JP1.56 JP1.36 JP1.16 64.77,43.18 59.37,43.18 5.1.P$3 | 5.1.P$9 5.1.P$7 5.1.P$5 5.1.P$3 | 5.1.P$3 5.1.P$4 | 5.1.P$4 5.1.P$6 5.1.P$8 5.1.P$10 | 5.1.P$4 59.37,30.48 2PIN_4.P$1
!EXT_USB_OVERCUR!  (2 unrouted)
!EXT_USB_PWR!  (1 unrouted)
!USB_5_OVERCUR!  (2 unrouted)
!USB_5_PWR!  (1 unrouted)
!USB_6_OVERCUR!  (2 unrouted)
!USB_6_PWR!  (1 unrouted)
ACT-PWR_POST-KILL  (via drill 0.6)  (2 unrouted)
  other vias: 77.47,25.4 74.93,24.13 77.47,22.86 77.47,20.32 74.93,19.05 77.47,17.78 91.44,17.78 93.98,17.78 96.52,17.78 95.25,20.32 92.71,20.32 92.71,22.86 95.25,22.86 96.52,25.4 93.98,25.4 91.44,25.4
  pour Bottom: 73.66,26.67 97.79,26.67 97.79,4.45 73.66,4.45
  pour Route15: 73.66,26.67 97.79,26.67 97.79,4.45 73.66,4.45
ACT-PWR_PRE-KILL  (via drill 0.6)  (4 unrouted)
  other vias: 96.52,29.21 93.98,29.21 91.44,29.21 92.71,31.75 95.25,31.75 96.52,34.29 93.98,34.29 91.44,34.29 88.9,34.29 86.36,34.29 83.82,34.29 81.28,34.29 78.74,34.29 76.2,34.29
  pour Bottom: 74.93,43.18 97.79,43.18 97.79,27.94 81.28,27.94 81.28,33.66 74.93,33.66
  pour Route15: 74.93,43.18 97.79,43.18 97.79,27.94 81.28,27.94 81.28,33.66 74.93,33.66
ACT_SCL  (5 unrouted)
  Bottom 0.152: 5.4.P$2 5.4.P$1
ACT_SDA  (5 unrouted)
  Bottom 0.152: 5.5.P$1 5.5.P$2
AHRS_USB_N  (3 unrouted)
AHRS_USB_P  (3 unrouted)
BATT1_SCL  (2 unrouted)
  Bottom 0.152: 5.4.P$4 5.4.P$3
BATT1_SCL_UNBUF  (1 unrouted)
BATT1_SDA  (2 unrouted)
  Bottom 0.152: 5.5.P$3 5.5.P$4
BATT1_SDA_UNBUF  (1 unrouted)
BATT2_SCL  (2 unrouted)
  Bottom 0.152: 5.4.P$6 5.4.P$5
BATT2_SCL_UNBUF  (1 unrouted)
BATT2_SDA  (2 unrouted)
  Bottom 0.152: 5.5.P$6 5.5.P$5
BATT2_SDA_UNBUF  (1 unrouted)
BATT_SCL  (4 unrouted)
BATT_SCL_UNBUF  (1 unrouted)
BATT_SDA  (4 unrouted)
BATT_SDA_UNBUF  (1 unrouted)
CANH  (8 unrouted)
CANL  (7 unrouted)
  Bottom 0.152: 5.3.P$7 5.3.P$8
CE_2  (3 unrouted)
CE_3  (3 unrouted)
CE_4  (3 unrouted)
CE_CPU  (4 unrouted)
CE_LEDS  (5 unrouted)
CTS_CF  (4 unrouted)
CTS_MC  (4 unrouted)
CTS_MD  (5 unrouted)
  Bottom 0.152: 5.2.P$6 5.2.P$5
CTS_MF  (3 unrouted)
CTS_PF  (3 unrouted)
CTS_SF  (3 unrouted)
DEPTH_SCL  (2 unrouted)
DEPTH_SDA  (2 unrouted)
DVL_H!CTS!  (1 unrouted)
DVL_H!RTS!  (1 unrouted)
DVL_HCTS  (2 unrouted)
  Bottom 0.152: 5.6.P$4 5.6.P$3
DVL_HRTS  (2 unrouted)
  Bottom 0.152: 5.6.P$6 5.6.P$5
DVL_HRX  (2 unrouted)
  Bottom 0.152: 5.6.P$10 5.6.P$9
DVL_HRXD  (1 unrouted)
DVL_HTX  (2 unrouted)
  Bottom 0.152: 5.6.P$8 5.6.P$7
DVL_HTXD  (1 unrouted)
DVL_HUSB_M  (2 unrouted)
DVL_HUSB_P  (2 unrouted)
DVL_S!CTS!  (1 unrouted)
DVL_S!RTS!  (1 unrouted)
DVL_SCTS  (2 unrouted)
  Bottom 0.152: 5.7.P$2 5.7.P$1
DVL_SRTS  (2 unrouted)
  Bottom 0.152: 5.5.P$10 5.5.P$9
DVL_SRX  (2 unrouted)
  Bottom 0.152: 5.6.P$2 5.6.P$1
DVL_SRXD  (1 unrouted)
DVL_STX  (2 unrouted)
  Bottom 0.152: 5.4.P$10 5.4.P$9
DVL_STXD  (1 unrouted)
DVL_SUSB_M  (2 unrouted)
DVL_SUSB_P  (2 unrouted)
DVL_USB_HUB_XTAL  (1 unrouted)
DVL_USB_N  (3 unrouted)
DVL_USB_P  (3 unrouted)
EXT_SCL  (5 unrouted)
  Bottom 0.152: 5.3.P$3 5.3.P$4
EXT_SDA  (5 unrouted)
  Bottom 0.152: 5.3.P$5 5.3.P$6
EXT_USB_5V  (4 unrouted)
  Bottom 0.152: 5.7.P$4 5.7.P$3
EXT_USB_N  (3 unrouted)
  Bottom 0.152: 5.7.P$10 5.7.P$9
EXT_USB_P  (3 unrouted)
  Bottom 0.152: 5.7.P$8 5.7.P$7
GND  (237 unrouted)
  Bottom 0.152: 5.2.P$2 5.2.P$1 | 5.3.P$1 5.3.P$2
  pour Route2: 5.08,2.54 96.52,2.54 96.52,5.08 100.33,5.08 100.33,149.86 97.79,149.86 97.79,152.4 34.29,152.4 34.29,140.97 19.05,140.97 19.05,46.99 2.29,46.99 2.54,33.02 2.54,5.08 5.08,5.08
GPIO_2  (3 unrouted)
GPIO_22  (3 unrouted)
GPIO_63  (3 unrouted)
HUB_USB_N  (2 unrouted)
HUB_USB_P  (3 unrouted)
HUB_USB_XTAL  (1 unrouted)
IMU_USB_N  (3 unrouted)
IMU_USB_P  (3 unrouted)
INT_SCL  (6 unrouted)
INT_SDA  (6 unrouted)
KILL-SWT-GATE  (2 unrouted)
  Bottom 0.61: 2PIN_4.P$2 80.46,30.48 U$41.GATE
MISO  (7 unrouted)
MOSI  (7 unrouted)
N$3  (1 unrouted)
N$4  (1 unrouted)
N$6  (3 unrouted)
N$7  (1 unrouted)
N$8  (1 unrouted)
N$9  (1 unrouted)
N$10  (2 unrouted)
N$11  (2 unrouted)
N$12  (2 unrouted)
N$13  (2 unrouted)
N$14  (1 unrouted)
N$15  (2 unrouted)
N$16  (2 unrouted)
N$17  (2 unrouted)
N$18  (2 unrouted)
N$19  (1 unrouted)
N$20  (2 unrouted)
N$21  (2 unrouted)
N$22  (1 unrouted)
N$23  (1 unrouted)
N$24  (1 unrouted)
N$25  (1 unrouted)
N$27  (2 unrouted)
N$28  (1 unrouted)
N$29  (2 unrouted)
N$30  (1 unrouted)
N$31  (1 unrouted)
N$32  (1 unrouted)
N$33  (1 unrouted)
N$34  (1 unrouted)
N$35  (1 unrouted)
N$36  (1 unrouted)
N$37  (1 unrouted)
N$38  (2 unrouted)
N$39  (3 unrouted)
N$40  (1 unrouted)
N$41  (2 unrouted)
N$42  (1 unrouted)
N$43  (1 unrouted)
N$44  (1 unrouted)
N$45  (1 unrouted)
N$46  (1 unrouted)
N$47  (2 unrouted)
N$48  (2 unrouted)
N$49  (2 unrouted)
N$50  (2 unrouted)
N$51  (2 unrouted)
N$53  (2 unrouted)
N$54  (1 unrouted)
N$55  (1 unrouted)
N$56  (1 unrouted)
N$57  (1 unrouted)
N$58  (2 unrouted)
N$59  (1 unrouted)
N$60  (2 unrouted)
N$61  (2 unrouted)
N$62  (2 unrouted)
N$63  (2 unrouted)
N$67  (1 unrouted)
N$68  (2 unrouted)
N$69  (2 unrouted)
N$70  (2 unrouted)
N$71  (1 unrouted)
N$73  (1 unrouted)
N$74  (2 unrouted)
N$75  (2 unrouted)
N$80  (2 unrouted)
N$83  (2 unrouted)
N$84  (1 unrouted)
N$85  (1 unrouted)
PWM_0  (3 unrouted)
PWM_1  (3 unrouted)
RTS_CF  (4 unrouted)
RTS_MC  (4 unrouted)
RTS_MD  (5 unrouted)
  Bottom 0.152: 5.2.P$4 5.2.P$3
RTS_MF  (3 unrouted)
RTS_PF  (3 unrouted)
RTS_SF  (3 unrouted)
RX_CF  (5 unrouted)
RX_MC  (5 unrouted)
RX_MD  (6 unrouted)
RX_MF  (3 unrouted)
RX_PF  (3 unrouted)
RX_SF  (3 unrouted)
SCL_1_UNBUF  (2 unrouted)
SDA_1_UNBUF  (2 unrouted)
SHORE_SCL  (2 unrouted)
  Bottom 0.152: 5.4.P$8 5.4.P$7
SHORE_SCL_UNBUF  (1 unrouted)
SHORE_SDA  (2 unrouted)
  Bottom 0.152: 5.5.P$8 5.5.P$7
SHORE_SDA_UNBUF  (1 unrouted)
SPI_CLK  (6 unrouted)
TX_CF  (5 unrouted)
TX_MC  (5 unrouted)
TX_MD  (5 unrouted)
  Bottom 0.152: 5.2.P$8 5.2.P$7
TX_MF  (3 unrouted)
TX_PF  (3 unrouted)
TX_SF  (3 unrouted)
USB-5_P  (1 unrouted)
USB_1_N  (3 unrouted)
USB_1_P  (3 unrouted)
USB_2_N  (3 unrouted)
USB_2_P  (3 unrouted)
USB_3_N  (3 unrouted)
USB_3_P  (3 unrouted)
USB_4_N  (3 unrouted)
USB_4_P  (3 unrouted)
USB_5_5V  (4 unrouted)
USB_5_M  (3 unrouted)
USB_5_P  (1 unrouted)
USB_6_5V  (4 unrouted)
USB_6_M  (3 unrouted)
USB_6_P  (3 unrouted)
V_BATT  (24 unrouted)
  pour Route15: 74.93,53.34 100.33,53.34 100.33,138.43 74.93,138.43